# EAGLE schematic Schematic (EAGLE 9.6.2)
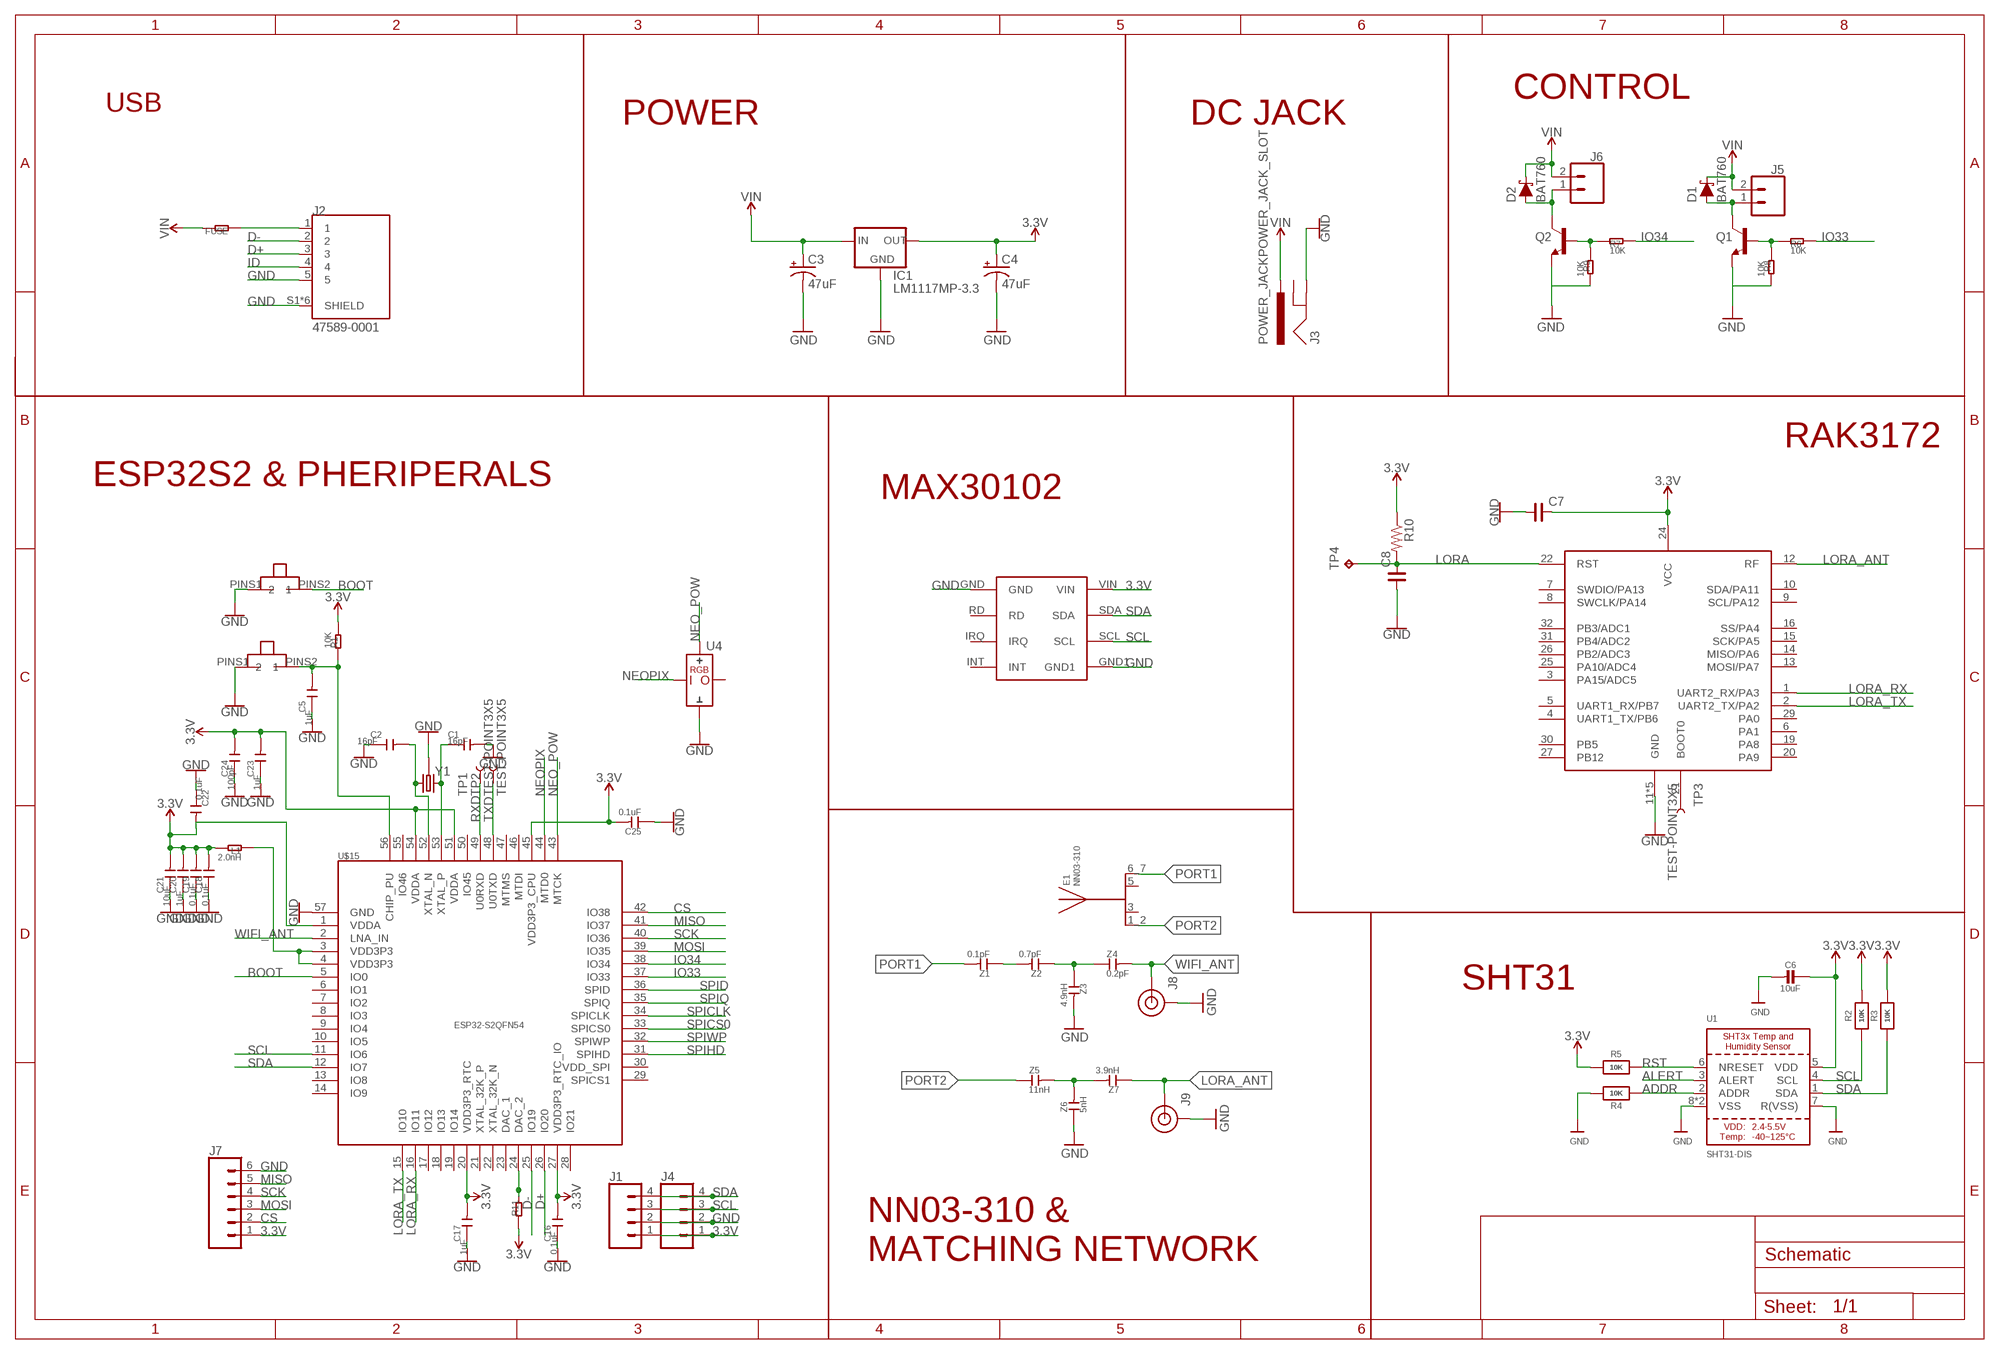
[diagram p0: schematic, sheet 1]

## Parts
C1  16pF  CAP-0603  [C0603]
C2  16pF  CAP-0603  [C0603]
C3  47uF  10UF-TANT  [EIA3216]
C4  47uF  10UF-TANT  [EIA3216]
C5  1uF  CAP-0603  [C0603]
C6  10uF  CAP_CERAMIC0805-NOOUTLINE  [0805-NO]
C7  C_0805  [C0805]
C8  C_0805  [C0805]
C16  0.1uF  CAP-0603  [C0603]
C17  1uF  CAP-0603  [C0603]
C18  0.1uF  CAP-0603  [C0603]
C19  0.1uF  CAP-0603  [C0603]
C20  1uF  CAP-0603  [C0603]
C21  10uF  CAP-0603  [C0603]
C22  0.1uF  CAP-0603  [C0603]
C23  1uF  CAP-0603  [C0603]
C24  100pF  CAP-0603  [C0603]
C25  0.1uF  CAP-0603  [C0603]
D1  BAT760  DIODE-SCHOTTKY-BAT60A  [SOD-323]
D2  BAT760  DIODE-SCHOTTKY-BAT60A  [SOD-323]
E1  NN03-310  [XCVR_NN03-310]
FUSE  2.0K  RES-0603  [R0603]
IC1  LM1117MP-3.3  [SOT223]
J1  CONN_041X04_NO_SILK  [1X04_NO_SILK]
J2  47589-0001  [MOLEX_47589-0001]
J3  POWER_JACKPOWER_JACK_SLOT  [POWER_JACK_PTH_SLOT]
J4  CONN_041X04_NO_SILK  [1X04_NO_SILK]
J5  CONN_021X02_NO_SILK  [1X02_NO_SILK]
J6  CONN_021X02_NO_SILK  [1X02_NO_SILK]
J7  CONN_06NO_SILK_FEMALE_PTH  [1X06_NO_SILK]
J8  U.FL2PIN-REDUCED-FOOTPRINT  [U.FL_REDUCED_FOOTPRINT]
J9  U.FL2PIN-REDUCED-FOOTPRINT  [U.FL_REDUCED_FOOTPRINT]
L1  2.0nH  RES-0603  [R0603]
Q1  500mA/300V  TRANS_NPN-MMBTA42  [SOT23-3]
Q2  500mA/300V  TRANS_NPN-MMBTA42  [SOT23-3]
R1  10K  RES-0603  [R0603]
R2  10K  RESISTOR0805_NOOUTLINE  [0805-NO]
R3  10K  RESISTOR0805_NOOUTLINE  [0805-NO]
R4  10K  RESISTOR_0805MP  [_0805MP]
R5  10K  RESISTOR0805_NOOUTLINE  [0805-NO]
R6  10K  RES-0603  [R0603]
R7  10K  RES-0603  [R0603]
R8  10K  RES-0603  [R0603]
R9  10K  RES-0603  [R0603]
R10  CRCW08050000Z0EA  [RES_0805]
R11  10K  RES-0603  [R0603]
TP1  TEST-POINT3X5  [PAD.03X.05]
TP2  TEST-POINT3X5  [PAD.03X.05]
TP3  TEST-POINT3X5  [PAD.03X.05]
TP4  TPTP12R  [TP12R]
U1  SHT31-DIS  SHT3X  [SHT3X]
U4  LED-ADDRESSABLE16MM  [LED-WS2812B-2020-RING]
U$1  TACTILE  [TACTILE]
U$2  TACTILE  [TACTILE]
U$3  MAX30102_BREAKOUT  [MAX30102]
U$4  RAK3172HF  [RAK3172]
U$15  ESP32-S2QFN54  [QFN40P700X700X90-57T400N]
Y1  CRYSTAL-GROUNDEDSMD-3.2X2.5  [CRYSTAL-SMD-3.2X2.5MM]
Z1  0.1pF  CAP-0603  [C0603]
Z2  0.7pF  CAP-0603  [C0603]
Z3  4.9nH  CAP-0603  [C0603]
Z4  0.2pF  CAP-0603  [C0603]
Z5  11nH  CAP-0603  [C0603]
Z6  5nH  CAP-0603  [C0603]
Z7  3.9nH  CAP-0603  [C0603]

## Nets
3.3V: C4.A(+) C6.1 C7.2 C16.2 C17.2 C18.2 C19.2 C20.2 C21.2 C22.2 C23.2 C24.2 C25.2 IC1.2(OUT) IC1.4(OUT) J1.1 J4.1 J7.1 L1.2 R1.2 R2.2 R3.2 R5.1 R10.1 R11.1 U1.5(VDD) U$3.VIN U$4.24(VCC) U$15.1(VDDA) U$15.20(VDD3P3_RTC) U$15.27(VDD3P3_RTC_IO) U$15.45(VDD3P3_CPU) U$15.51(VDDA) U$15.54(VDDA)
ADDR: R4.1 U1.2(ADDR)
ALERT: U1.3(ALERT)
BOOT: U$2.PINS2 U$15.5(IO0)
CS: J7.2 U$15.42(IO38)
D+: J2.3 U$15.26(IO20)
D-: J2.2 U$15.25(IO19)
GND: C1.2 C2.1 C3.C(-) C4.C(-) C5.1 C6.2 C7.1 C8.1 C16.1 C17.1 C18.1 C19.1 C20.1 C21.1 C22.1 C23.1 C24.1 C25.1 IC1.1(GND) J1.2 J2.5 J2.S1(SHIELD) J2.S2(SHIELD) J2.S3(SHIELD) J2.S4(SHIELD) J2.S5(SHIELD) J2.S6(SHIELD) J3.GND J4.2 J7.6 J8.1(GND) J8.2(GND) J9.1(GND) J9.2(GND) Q1.2(E) Q2.2(E) R4.2 R8.2 R9.2 U1.7(R(VSS)) U1.8(VSS) U1.THERMAL(VSS) U4.GND U$1.PINS1 U$2.PINS1 U$3.GND U$3.GND1 U$4.11(GND) U$4.17(GND) U$4.18(GND) U$4.23(GND) U$4.28(GND) U$15.57(GND) Y1.2(GND) Y1.4(GND) Z3.2 Z6.1
ID: J2.4
IO33: R6.2 U$15.37(IO33)
IO34: R7.2 U$15.38(IO34)
LORA: C8.2 R10.2 TP4.TP U$4.22(RST)
LORA_ANT: J9.FEED(SIGNAL) U$4.12(RF) Z7.1
LORA_RX: U$4.1(UART2_RX/PA3) U$15.16(IO11)
LORA_TX: U$4.2(UART2_TX/PA2) U$15.15(IO10)
MISO: J7.5 U$15.41(IO37)
MOSI: J7.3 U$15.39(IO35)
N$1: C2.2 U$15.52(XTAL_N) Y1.3
N$2: C1.1 U$15.53(XTAL_P) Y1.1
N$3: C5.2 R1.1 U$1.PINS2 U$15.56(CHIP_PU)
N$4: L1.1 U$15.3(VDD3P3) U$15.4(VDD3P3)
N$5: Q1.1(B) R6.1 R8.1
N$6: FUSE.1 J2.1
N$7: Q2.1(B) R7.1 R9.1
N$8: TP3.P$1 U$4.21(BOOT0)
N$9: R11.2 U$15.24(DAC_2)
N$10: Z1.1 Z2.2
N$11: D1.A J5.1 Q1.3(C)
N$12: Z2.1 Z3.1 Z4.1
N$13: Z5.2 Z6.2 Z7.2
N$14: D2.A J6.1 Q2.3(C)
NEO_POW: U4.+(VDD) U$15.43(MTCK)
NEOPIX: U4.DI U$15.44(MTD0)
PORT1: E1.6_7 Z1.2
PORT2: E1.1_2 Z5.1
RST: R5.2 U1.6(NRESET)
RXD: TP1.P$1 U$15.49(U0RXD)
SCK: J7.4 U$15.40(IO36)
SCL: J1.3 J4.3 R2.1 U1.4(SCL) U$3.SCL U$15.11(IO6)
SDA: J1.4 J4.4 R3.1 U1.1(SDA) U$3.SDA U$15.12(IO7)
SPICLK: U$15.34(SPICLK)
SPICS0: U$15.33(SPICS0)
SPID: U$15.36(SPID)
SPIHD: U$15.31(SPIHD)
SPIQ: U$15.35(SPIQ)
SPIWP: U$15.32(SPIWP)
TXD: TP2.P$1 U$15.48(U0TXD)
VIN: C3.A(+) D1.C D2.C FUSE.2 IC1.3(IN) J3.PWR J5.2 J6.2
WIFI_ANT: J8.FEED(SIGNAL) U$15.2(LNA_IN) Z4.2
Unconnected: E1.3 E1.5 J3.GNDBREAK U4.DO U$3.INT U$3.IRQ U$3.RD U$4.3(PA15/ADC5) U$4.4(UART1_TX/PB6) U$4.5(UART1_RX/PB7) U$4.6(PA1) U$4.7(SWDIO/PA13) U$4.8(SWCLK/PA14) U$4.9(SCL/PA12) U$4.10(SDA/PA11) U$4.13(MOSI/PA7) U$4.14(MISO/PA6) U$4.15(SCK/PA5) U$4.16(SS/PA4) U$4.19(PA8) U$4.20(PA9) U$4.25(PA10/ADC4) U$4.26(PB2/ADC3) U$4.27(PB12) U$4.29(PA0) U$4.30(PB5) U$4.31(PB4/ADC2) U$4.32(PB3/ADC1) U$15.6(IO1) U$15.7(IO2) U$15.8(IO3) U$15.9(IO4) U$15.10(IO5) U$15.13(IO8) U$15.14(IO9) U$15.17(IO12) U$15.18(IO13) U$15.19(IO14) U$15.21(XTAL_32K_P) U$15.22(XTAL_32K_N) U$15.23(DAC_1) U$15.28(IO21) U$15.29(SPICS1) U$15.46(MTDI) U$15.47(MTMS) U$15.50(IO45) U$15.55(IO46)

## Notes on the sheet
- CONTROL
- USB
- POWER | DC JACK
- RAK3172
- ESP32S2 & PHERIPERALS
- MAX30102
- SHT31
- NN03-310 & 
  MATCHING NETWORK

## Power pins joined to a net without a drawn wire
VDD_SPI: U$15.30(VDD_SPI)

## Library data of the parts
C1 C2 C5 C16-C25 Z1-Z7 = RAK3172-Breakout:CAP: Ceramic Capacitors
C3 C4 = SparkFun-Retired:10UF-TANT: 10uF Tantalum SMT CAP-00811- 16V 10% (EIA-3216); PROD_ID: CAP-00811; VALUE: 10uF
C6 = microbuilder:CAP_CERAMIC: Ceramic Capacitors For new designs, use the packages preceded by an '_' character since they are more reliable: The following footprints should be used on most boards: _0402 - Standard footprint for regular board layouts _0603 - Standard footprint for regular board layouts _0805 - Standard footprint for regular board layouts _1206 - Standard footprint for regular board layouts For extremely tight-pitch boards where space is at a premium, the following 'micro-pitch' footprints can be used (smaller pads, no silkscreen outline, etc.): _0402MP - Micro-pitch footprint for very dense/compact boards _0603MP - Micro-pitch footprint for very dense/compact boards _0805MP - Micro-pitch footprint for very dense/compact boards _1206MP - Micro-pitch footprint for very dense/compact boards
C7 C8 = rc-master-smd:C_: NON-POLARIZED CAP
D1 D2 = SparkFun-DiscreteSemi:DIODE-SCHOTTKY: Schottky diode A Schottky diode is a semiconductor diode which has a low forward voltage drop and a very fast switching action.; PROD_ID: DIO-14072; VALUE: 3A/10V/280mV
E1 = NN03-310:NN03-310: 700MHz, 800MHz, 850MHz, 900MHz, 1.7GHz, 1.8GHz, 1.9GHz, 2GHz, 2.1GHz, 2.3GHz, 2.5GHz, 2.6GHz DCS, GSM, LTE, PCS, UMTS Chip RF Antenna 698MHz ~ 960MHz, 1.71GHz ~ 2.69GHz 1.1dBi, 2.4dBi Solder Surface Mount Check availability <https://pricing.snapeda.com/parts/NN03-310/Ignion/view-part?ref=eda>; AVAILABILITY: In Stock; DESCRIPTION: Multiport top performance chip antenna component for GSM, UMTS, LTE, 5G, GNSS, Bluetooth (617 - 960MHz, 1710 - 2690MHz, 3300 - 3800MHz, 1561 - 1606 MHz and 2400 - 2500 MHz), signal booster; MF: Ignion; MP: NN03-310; PACKAGE: None; PRICE: None; PURCHASE-URL: https://pricing.snapeda.com/search/part/NN03-310/?ref=eda
FUSE L1 R1 R6-R9 R11 = RAK3172-Breakout:RES
IC1 = lm1117_10:LM1117?-*: 800mA Low-Dropout Linear Regulator Source: http://www.ti.com/lit/ds/symlink/lm1117-n.pdf; MF: Texas Instruments; MPN: LM1117MP-3.3; OC_FARNELL: 9778195; OC_NEWARK: 28X3416
J1 J4 = SparkFun-Connectors:CONN_04: Multi connection point. Often used as Generic Header-pin footprint for 0.1 inch spaced/style header connections On any of the 0.1 inch spaced packages, you can populate with these: Break Away Headers - Straight <https://www.sparkfun.com/products/116> (PRT-00116) Break Away Male Headers - Right Angle <https://www.sparkfun.com/products/553> (PRT-00553) Female Headers <https://www.sparkfun.com/products/115> (PRT-00115) Break Away Headers - Machine Pin <https://www.sparkfun.com/products/117> (PRT-00117) Break Away Female Headers - Swiss Machine Pin <https://www.sparkfun.com/products/743> (PRT-00743) For SCREWTERMINALS and SPRING TERMINALS visit here: Screw Terimnals on SparkFun.com <https://www.sparkfun.com/search/results?term=Screw+Terminals> (5mm/3.5mm/2.54mm spacing) This device is also useful as a general connection point to wire up your design to another part of your project. Our various solder wires solder well into these plated through hole pads. Hook-Up Wire - Assortment (Stranded, 22 AWG) <https://www.sparkfun.com/products/11375> (PRT-11375) Hook-Up Wire - Assortment (Solid Core, 22 AWG) <https://www.sparkfun.com/products/11367> (PRT-11367) View the entire wire category on our website here <https://www.sparkfun.com/categories/141> Special notes: Molex polarized connector foot print use with SKU : PRT-08231 with associated crimp pins and housings. 1MM SMD Version SKU: PRT-10208; PROD_ID: CONN-09696
J2 = 47589-0001:47589-0001: Stainless Steel Extractor for Camera Socket, 6.5x6.5 Type, Lead free Check availability <https://pricing.snapeda.com/parts/47589-0001/Molex/view-part?ref=eda>; AVAILABILITY: In Stock; DESCRIPTION: USB - micro AB Receptacle Connector 5 Position Surface Mount, Right Angle; Through Hole; MF: Molex; MP: 47589-0001; PACKAGE: None; PRICE: None; PURCHASE-URL: https://pricing.snapeda.com/search/part/47589-0001/?ref=eda
J3 = SparkFun-Connectors:POWER_JACK: Power Jack Connector This is the standard 5.5mm barrel jack for power. The PTH is the most common, proven, reliable, footprint. The Slot footprint only works if the mill layer is transmitted to the PCB fab house so be warned. Here are the connectors we sell at SparkFun: DC Barrel Power Jack/Connector <https://www.sparkfun.com/products/119> (PRT-00119) DC Barrel Power Jack/Connector (SMD) <https://www.sparkfun.com/products/12748> (PRT-12748) DC Barrel Jack Adapter - Breadboard Compatible <https://www.sparkfun.com/products/10811> (PRT-10811) It is used on this SparkFun product (and many, many others): SparkFun RedBoard - Programmed with Arduino <https://www.sparkfun.com/products/12757> (DEV-12757) Also, if you need a mating power supply or connector, please check these out: Wall Adapter Power Supply - 9VDC 650mA <https://www.sparkfun.com/products/298> (TOL-00298) DC Barrel Jack Adapter - Male <https://www.sparkfun.com/products/10287> (PRT-10287); PROD_ID: CONN-08197
J5 J6 = SparkFun-Connectors:CONN_02: Multi connection point. Often used as Generic Header-pin footprint for 0.1 inch spaced/style header connections On any of the 0.1 inch spaced packages, you can populate with these: Break Away Headers - Straight <https://www.sparkfun.com/products/116> (PRT-00116) Break Away Male Headers - Right Angle <https://www.sparkfun.com/products/553> (PRT-00553) Female Headers <https://www.sparkfun.com/products/115> (PRT-00115) Break Away Headers - Machine Pin <https://www.sparkfun.com/products/117> (PRT-00117) Break Away Female Headers - Swiss Machine Pin <https://www.sparkfun.com/products/743> (PRT-00743) For SCREWTERMINALS and SPRING TERMINALS visit here: Screw Terimnals on SparkFun.com <https://www.sparkfun.com/search/results?term=Screw+Terminals> (5mm/3.5mm/2.54mm spacing) This device is also useful as a general connection point to wire up your design to another part of your project. Our various solder wires solder well into these plated through hole pads. Hook-Up Wire - Assortment (Stranded, 22 AWG) <https://www.sparkfun.com/products/11375> (PRT-11375) Hook-Up Wire - Assortment (Solid Core, 22 AWG) <https://www.sparkfun.com/products/11367> (PRT-11367) View the entire wire category on our website here <https://www.sparkfun.com/categories/141> Special notes: Molex polarized connector foot print use with: PRT-08233 with associated crimp pins and housings. 2.54_SCREWTERM for use with PRT-10571. 3.5mm Screw Terminal footprints for PRT-08084 5mm Screw Terminal footprints for use with PRT-08432
J7 = SparkFun-Connectors:CONN_06: Multi connection point. Often used as Generic Header-pin footprint for 0.1 inch spaced/style header connections On any of the 0.1 inch spaced packages, you can populate with these: Break Away Headers - Straight <https://www.sparkfun.com/products/116> (PRT-00116) Break Away Male Headers - Right Angle <https://www.sparkfun.com/products/553> (PRT-00553) Female Headers <https://www.sparkfun.com/products/115> (PRT-00115) Break Away Headers - Machine Pin <https://www.sparkfun.com/products/117> (PRT-00117) Break Away Female Headers - Swiss Machine Pin <https://www.sparkfun.com/products/743> (PRT-00743) Arduino Stackable Header - 6 Pin <https://www.sparkfun.com/products/9280> (PRT-09280) For SCREWTERMINALS and SPRING TERMINALS visit here: Screw Terimnals on SparkFun.com <https://www.sparkfun.com/search/results?term=Screw+Terminals> (5mm/3.5mm/2.54mm spacing) This device is also useful as a general connection point to wire up your design to another part of your project. Our various solder wires solder well into these plated through hole pads. Hook-Up Wire - Assortment (Stranded, 22 AWG) <https://www.sparkfun.com/products/11375> (PRT-11375) Hook-Up Wire - Assortment (Solid Core, 22 AWG) <https://www.sparkfun.com/products/11367> (PRT-11367) View the entire wire category on our website here <https://www.sparkfun.com/categories/141>; PROD_ID: CONN-08437
J8 J9 = SparkFun-Connectors:U.FL2PIN: SMD Antenna Connector - U.FL 2mm height, 3.0mm x 3.0mm receptacle size. SparkFun Products: SparkFun WiFi Shield - ESP8266 <https://www.sparkfun.com/products/13287> SparkFun ESP8266 Thing <https://www.sparkfun.com/products/13231> SparkFun MiniGen - Pro Mini Signal Generator Shield <https://www.sparkfun.com/products/11420>; PROD_ID: CONN-09193
Q1 Q2 = SparkFun-DiscreteSemi:TRANS_NPN: NPN transistor Current controlled devices typically used to amplify current or used as a switch. BC547 - COM-08928 <http://www.sparkfun.com/products/8928> (TO-92 45V 100mA) (1.Collector 2.Base 3.Emitter) 2N3904 - COM-00521 <http://www.sparkfun.com/products/521> (TO-92 40V 200mA) (1.Emitter 2.Base 3.Collector) P2N2222A - COM-12852 <http://www.sparkfun.com/products/12852> (TO-92 40V 600mA) (1.Collector 2.Base 3.Emitter); PROD_ID: TRANS-09116
R2-R5 = microbuilder:RESISTOR: Resistors For new designs, use the packages preceded by an '_' character since they are more reliable: The following footprints should be used on most boards: _0402 - Standard footprint for regular board layouts _0603 - Standard footprint for regular board layouts _0805 - Standard footprint for regular board layouts _1206 - Standard footprint for regular board layouts For extremely tight-pitch boards where space is at a premium, the following 'micro-pitch' footprints can be used (smaller pads, no silkscreen outline, etc.): _0402MP - Micro-pitch footprint for very dense/compact boards _0603MP - Micro-pitch footprint for very dense/compact boards _0805MP - Micro-pitch footprint for very dense/compact boards _1206MP - Micro-pitch footprint for very dense/compact boards
R10 = Resistor_Capacitor:CRCW08050000Z0EA: RES SMD 0 OHM JUMPER 1/8W 0805 Manufacturer's datasheet <http://www.vishay.com/docs/20035/dcrcwe3.pdf>; CREATED_BY: PCBLayout.com; DIGIKEY_PART_NUMBER: 541-0.0ATR-ND; MANUFACTURER: Vishay Dale; MPN: CRCW08050000Z0EA; PACKAGE: SMD 0805
TP1-TP3 = SparkFun-Connectors:TEST-POINT: SparkFun Test Points Bare copper test points for troubleshooting or In-Circuit-Testing. These are used by our Production team for verifying production board runs using pogo-pins on test beds. SparkFun Products: SparkFun LSM9DS1 Breakout <https://www.sparkfun.com/products/13284> SparkFun PSOC <https://www.sparkfun.com/products/13714> SparkFun Load Cell Amplifier <https://www.sparkfun.com/products/13879>
TP4 = testpad:TP: Test pad
U1 = microbuilder:SHT3X: SHT3x - Digital Temperature and Humidity Sensor Supply Voltage: 2.4-5.5V Humidity Accuracy: SHT30 = +/-3%RH, SHT31 = +/-2%RH Temperature Sensor: -40~125°C (+/-0.3°C from 10-55C)
U4 = ALBERT:LED-ADDRESSABLE
U$1 U$2 = Tactile-3x6x4.3:TACTILE
U$3 = MAX30102 Breakout:MAX30102_BREAKOUT
U$4 = RAK3172-Breakout:RAK3172: RAK4260 LoRaWAN module from RAKwireless.
U$15 = adafruit_wireless:ESP32-S2; DESCRIPTION: WiFi 802.11b/g/n Transceiver Module 2.4GHz Antenna Not Included Surface Mount; DIGI-KEY_PART_NUMBER: 1965-ESP32-S2CT-ND; MF: Espressif Systems; MP: ESP32-S2; PACKAGE: None; PURCHASE-URL: https://pricing.snapeda.com/search/part/ESP32-S2/?ref=eda
Y1 = SparkFun-Clocks:CRYSTAL-GROUNDED: Crystals w/ Ground Pin (Generic) These are passive quartz crystals, which can be used as a clock source for a microcontroller. Crystal's are usually two-terminal devices. A third terminal may be optionally connected to ground, as recommended by the manufaturer.

## Net classes
0 Default: width 0.203 mm
2 3.3V: width 0.305 mm